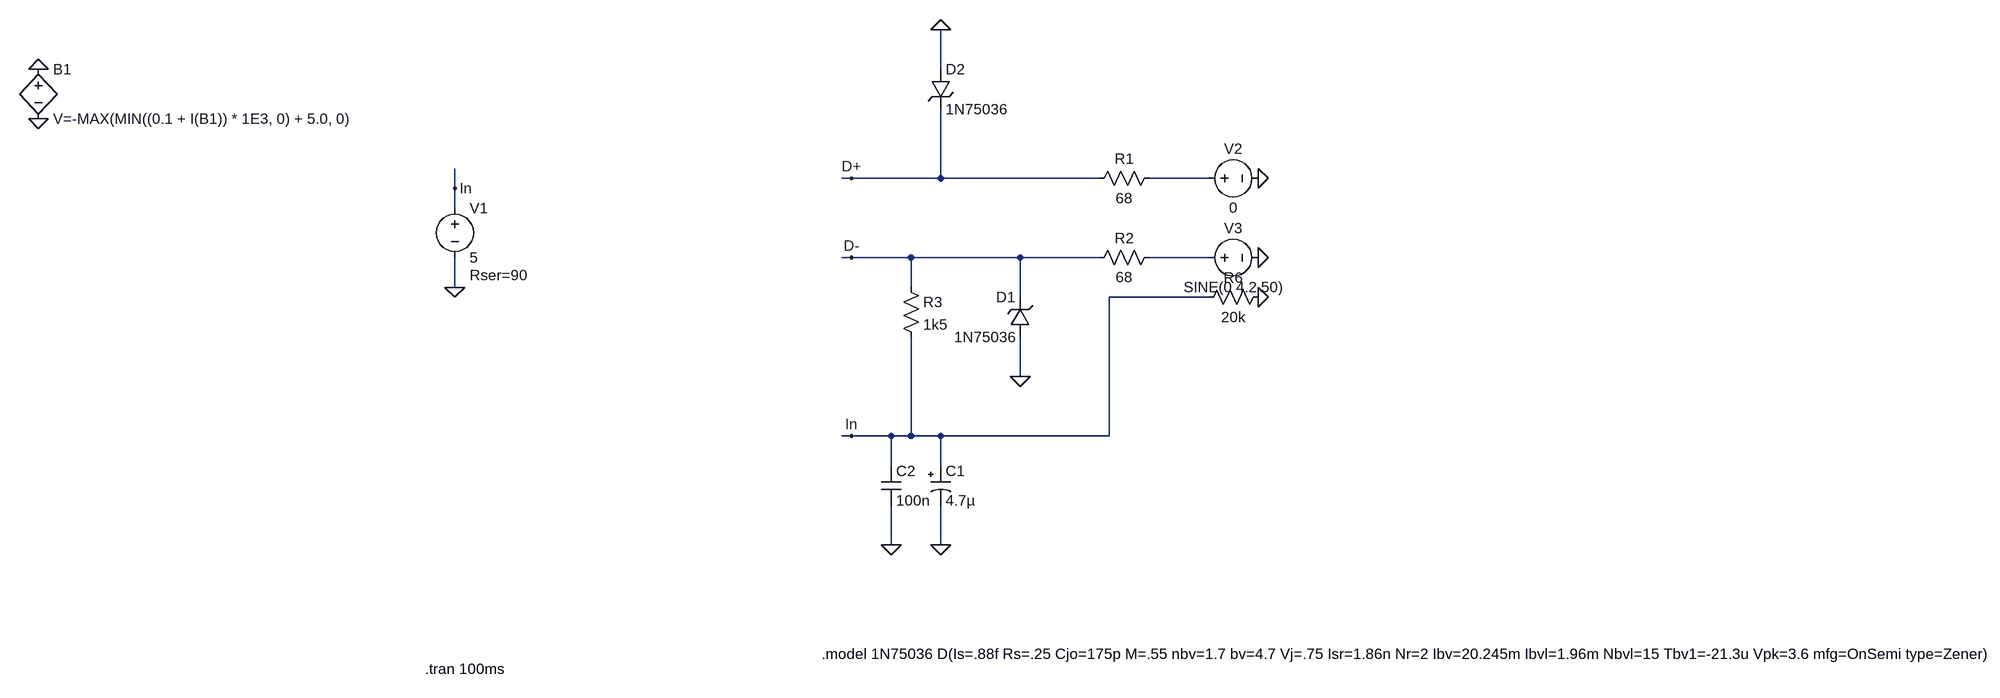
[diagram p0: schematic Draft1.asc]
Draft1.asc, the LTspice schematic file:
Version 4
SHEET 1 1856 952
WIRE -336 -32 -336 -96
WIRE -480 144 -496 144
WIRE -336 144 -336 32
WIRE -336 144 -480 144
WIRE -80 144 -336 144
WIRE 96 144 0 144
WIRE -1120 160 -1120 128
WIRE -1120 192 -1120 160
WIRE -480 272 -496 272
WIRE -384 272 -480 272
WIRE -208 272 -384 272
WIRE -80 272 -208 272
WIRE 96 272 0 272
WIRE -1120 320 -1120 272
WIRE -384 320 -384 272
WIRE -208 336 -208 272
WIRE 96 336 -64 336
WIRE -208 464 -208 400
WIRE -480 560 -496 560
WIRE -416 560 -480 560
WIRE -384 560 -384 400
WIRE -384 560 -416 560
WIRE -336 560 -384 560
WIRE -64 560 -64 336
WIRE -64 560 -336 560
WIRE -416 608 -416 560
WIRE -336 608 -336 560
WIRE -416 736 -416 672
WIRE -336 736 -336 672
FLAG -208 464 0
FLAG -336 736 0
FLAG -480 144 D+
FLAG -480 560 In
FLAG -336 -96 0
FLAG -416 736 0
FLAG -1120 160 In
FLAG -1120 320 0
FLAG 176 336 0
FLAG -1792 48 0
FLAG -1792 -32 0
FLAG -480 272 D-
FLAG 176 144 0
FLAG 176 272 0
SYMBOL res 16 128 R90
WINDOW 0 0 56 VBottom 2
WINDOW 3 32 56 VTop 2
SYMATTR InstName R1
SYMATTR Value 68
SYMBOL res 16 256 R90
WINDOW 0 0 56 VBottom 2
WINDOW 3 32 56 VTop 2
SYMATTR InstName R2
SYMATTR Value 68
SYMBOL zener -192 400 R180
WINDOW 0 24 64 Left 2
WINDOW 3 24 0 Left 2
SYMATTR InstName D1
SYMATTR Value 1N75036
SYMBOL zener -352 -32 R0
SYMATTR InstName D2
SYMATTR Value 1N75036
SYMBOL polcap -352 608 R0
WINDOW 3 24 56 Left 2
SYMATTR Value 4.7µ
SYMATTR InstName C1
SYMATTR Description Capacitor
SYMATTR Type cap
SYMATTR SpiceLine V=50 Irms=30m Rser=4.7 Lser=0 mfg="Nichicon" pn="UPR1H4R7MAH" type="Al electrolytic"
SYMBOL cap -432 608 R0
SYMATTR InstName C2
SYMATTR Value 100n
SYMBOL voltage -1120 176 R0
WINDOW 123 0 0 Left 2
WINDOW 39 24 124 Left 2
SYMATTR InstName V1
SYMATTR Value 5
SYMATTR SpiceLine Rser=90
SYMBOL res 192 320 R90
WINDOW 0 0 56 VBottom 2
WINDOW 3 32 56 VTop 2
SYMATTR InstName R6
SYMATTR Value 20k
SYMBOL bv -1792 -48 R0
SYMATTR InstName B1
SYMATTR Value V=-MAX(MIN((0.1 + I(B1)) * 1E3, 0) + 5.0, 0)
SYMBOL res -400 304 R0
SYMATTR InstName R3
SYMATTR Value 1k5
SYMBOL voltage 80 144 R270
WINDOW 0 32 56 VTop 2
WINDOW 3 -32 56 VBottom 2
WINDOW 123 0 0 Left 2
WINDOW 39 0 0 Left 2
SYMATTR InstName V2
SYMATTR Value 0
SYMBOL voltage 80 272 R270
WINDOW 0 32 56 VTop 2
WINDOW 3 -32 56 VBottom 2
WINDOW 123 0 0 Left 2
WINDOW 39 0 0 Left 2
SYMATTR InstName V3
SYMATTR Value SINE(0 4.2 50)
TEXT -528 912 Left 2 !.model 1N75036 D(Is=.88f Rs=.25 Cjo=175p M=.55 nbv=1.7 bv=4.7 Vj=.75 Isr=1.86n Nr=2 Ibv=20.245m Ibvl=1.96m Nbvl=15 Tbv1=-21.3u Vpk=3.6 mfg=OnSemi type=Zener)
TEXT -1168 936 Left 2 !.tran 100ms

The netlist it stands for:
* Draft1.asc
R1 N001 D+ 68
R2 N002 D- 68
D1 0 D- 1N75036
D2 0 D+ 1N75036
C1 In 0 4.7µ V=50 Irms=30m Rser=4.7 Lser=0 mfg="Nichicon" pn="UPR1H4R7MAH" type="Al electrolytic"
C2 In 0 100n
V1 In 0 5 Rser=90
R6 0 In 20k
B1 0 0 V=-MAX(MIN((0.1 + I(B1)) * 1E3, 0) + 5.0, 0)
R3 D- In 1k5
V2 N001 0 0
V3 N002 0 SINE(0 4.2 50)
.model D D
.lib standard.dio
.model 1N75036 D(Is=.88f Rs=.25 Cjo=175p M=.55 nbv=1.7 bv=4.7 Vj=.75 Isr=1.86n Nr=2 Ibv=20.245m Ibvl=1.96m Nbvl=15 Tbv1=-21.3u Vpk=3.6 mfg=OnSemi type=Zener)
.tran 100ms
.backanno
.end